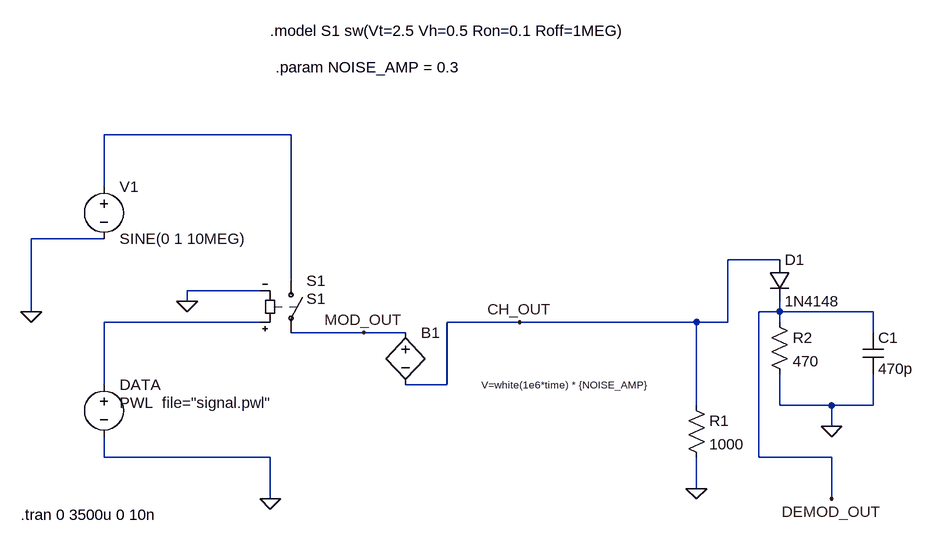
[diagram p0: schematic Modulator_with_demod_FIXED.asc]
Modulator_with_demod_FIXED.asc, the LTspice schematic file:
Version 4.1
SHEET 1 1336 708
WIRE 368 -48 80 -48
WIRE 80 32 80 -48
WIRE 80 112 -32 112
WIRE 1120 144 1040 144
WIRE 368 176 368 -48
WIRE 320 192 208 192
WIRE 208 208 208 192
WIRE -32 224 -32 112
WIRE 1120 224 1120 208
WIRE 1120 224 1088 224
WIRE 1264 224 1120 224
WIRE 320 240 80 240
WIRE 720 240 608 240
WIRE 992 240 720 240
WIRE 1040 240 1040 144
WIRE 1040 240 992 240
WIRE 1120 240 1120 224
WIRE 480 256 368 256
WIRE 544 256 480 256
WIRE 1264 256 1264 224
WIRE 80 336 80 240
WIRE 608 336 608 240
WIRE 608 336 544 336
WIRE 992 368 992 240
WIRE 1120 368 1120 320
WIRE 1200 368 1120 368
WIRE 1264 368 1264 320
WIRE 1264 368 1200 368
WIRE 1200 400 1200 368
WIRE 80 448 80 416
WIRE 336 448 80 448
WIRE 1088 448 1088 224
WIRE 1200 448 1088 448
WIRE 992 496 992 448
WIRE 336 512 336 448
WIRE 1200 512 1200 448
FLAG 336 512 0
FLAG -32 224 0
FLAG 208 208 0
FLAG 480 256 MOD_OUT
FLAG 720 240 CH_OUT
FLAG 992 496 0
FLAG 1200 400 0
FLAG 1200 512 DEMOD_OUT
SYMBOL voltage 80 16 R0
WINDOW 123 0 0 Left 0
WINDOW 39 0 0 Left 0
SYMATTR InstName V1
SYMATTR Value SINE(0 1 10MEG)
SYMBOL voltage 80 320 R0
WINDOW 123 0 0 Left 0
WINDOW 39 0 0 Left 0
WINDOW 3 24 44 Left 2
SYMATTR Value PWL  file="signal.pwl"
SYMATTR InstName DATA
SYMBOL sw 368 160 R0
WINDOW 3 24 44 Left 2
SYMATTR Value S1
SYMATTR InstName S1
SYMBOL bv 544 240 R0
WINDOW 3 243 96 Center 1
SYMATTR Value V=white(1e6*time) * {NOISE_AMP}
SYMATTR InstName B1
SYMBOL res 976 352 R0
SYMATTR InstName R1
SYMATTR Value 1000
SYMBOL diode 1104 144 R0
SYMATTR InstName D1
SYMATTR Value 1N4148
SYMBOL res 1104 224 R0
SYMATTR InstName R2
SYMATTR Value 470
SYMBOL cap 1248 256 R0
SYMATTR InstName C1
SYMATTR Value 470p
TEXT -48 536 Left 2 !.tran 0 3500u 0 10n
TEXT 336 -208 Left 2 !.model S1 sw(Vt=2.5 Vh=0.5 Ron=0.1 Roff=1MEG)
TEXT 344 -152 Left 2 !.param NOISE_AMP = 0.3

The netlist it stands for:
* Modulator_with_demod_FIXED.asc
V1 N001 0 SINE(0 1 10MEG)
V§DATA N002 0 PWL  file="signal.pwl"
S1 N001 MOD_OUT N002 0 S1
B1 MOD_OUT CH_OUT V=white(1e6*time) * {NOISE_AMP}
R1 CH_OUT 0 1000
D1 CH_OUT DEMOD_OUT 1N4148
R2 DEMOD_OUT 0 470
C1 DEMOD_OUT 0 470p
.model D D
.lib standard.dio
.tran 0 3500u 0 10n
.model S1 sw(Vt=2.5 Vh=0.5 Ron=0.1 Roff=1MEG)
.param NOISE_AMP = 0.3
.backanno
.end